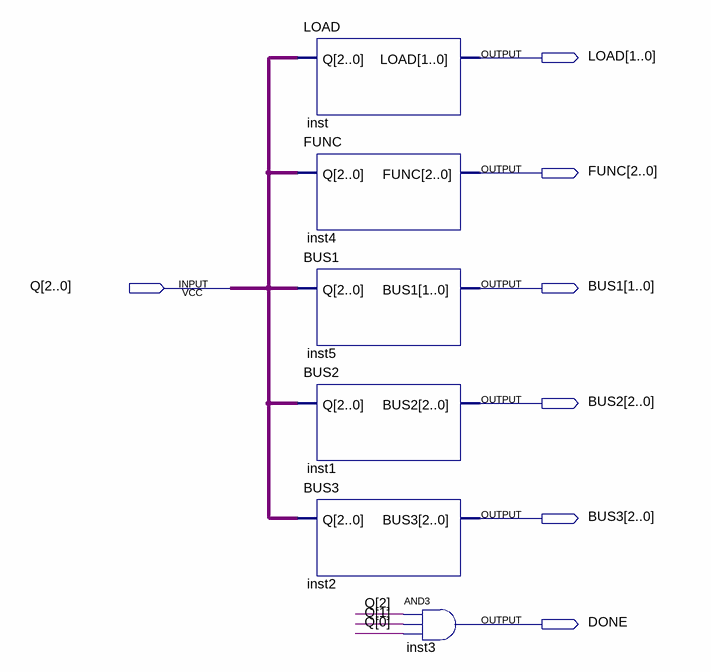
[diagram p0: schematic sheet]
// Quartus schematic OUTPUT_CONTROL.bdf as structural Verilog: 6 symbols, 7 pins
module OUTPUT_CONTROL (
  input  [2:0] Q,
  output [1:0] LOAD,
  output [2:0] FUNC,
  output [1:0] BUS1,
  output [2:0] BUS2,
  output [2:0] BUS3,
  output DONE
);

  LOAD inst (.Q(Q), .LOAD(LOAD));
  FUNC inst4 (.Q(Q), .FUNC(FUNC));
  BUS1 inst5 (.Q(Q), .BUS1(BUS1));
  BUS2 inst1 (.Q(Q), .BUS2(BUS2));
  BUS3 inst2 (.Q(Q), .BUS3(BUS3));
  and inst3 (DONE, Q[2], Q[1], Q[0]);
endmodule
